# Altium schematic sheet CLK.SchDoc: CLK
size A4; SheetNumber: 1
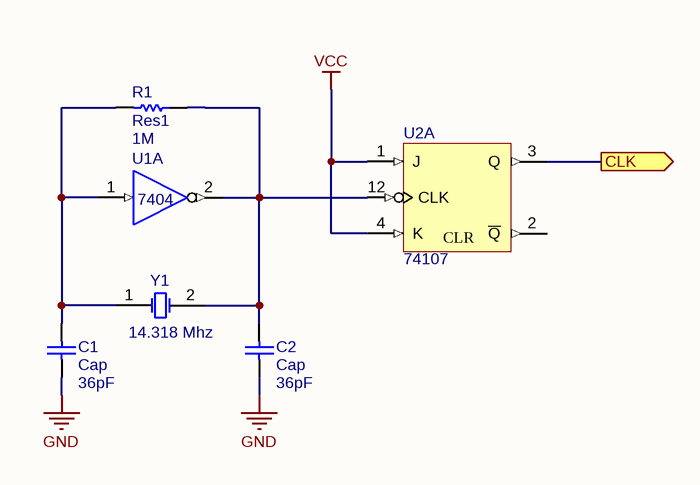
[diagram p0: CLK.SchDoc]

## Parts
C1  Cap  value 36pF  [CAPR10.16-11.5x3.6]
C2  Cap  value 36pF  [CAPR10.16-11.5x3.6]
R1  Res1  value 1M  [AXIAL-0.4]
U1  7404  [N014]  (part A of 6)
U2  74107  [N014D]  (part A of 2)
Y1  14.318 Mhz  [HC-49U]

## Ports
CLK

## Nets
GND: C1.1 C2.1 U1.7(GND) U2.7(GND)
VCC: U1.14(VCC) U2.1(J) U2.4(K) U2.13(CLR) U2.14(VCC)
CLK: U2.3(Q) ; port CLK
NetC1_2: C1.2 R1.2 U1.1(A) Y1.1(OSC1)
NetC2_2: C2.2 R1.1 U1.2(Y) U2.12(CLK) Y1.2(OSC2)

Not connected (* = marked no-connect by the designer): U2 2(~{Q})

## Notes on the sheet
- Text
- Page
- PONG

## Library data of the parts
C1 C2 = Cap: Capacitor; Published: 8-Jun-2000; LatestRevisionDate: 17-Jul-2002; LatestRevisionNote: Re-released for DXP Platform.; PackageReference: RAD-0.3; Publisher: Altium Limited; PackageDescription: Radial Cap, Thru-Hole; 2 Leads; 0.3 in Pin Spacing
R1 = Res1: Resistor; Published: 8-Jun-2000; LatestRevisionDate: 17-Jul-2002; LatestRevisionNote: Re-released for DXP Platform.; PackageReference: AXIAL-0.3; Publisher: Altium Limited; PackageDescription: Axial Device, Thru-Hole; 2 Leads; 0.3 in Pin Spacing
U1 = SN74LS04N: Hex Inverter; Published: 8-Jun-2000; LatestRevisionDate: 04-Mar-2005; LatestRevisionNote: Stylized 3D Model Added.; DatasheetVersion: Mar-1988; PackageVersion: Oct-1995; PackageReference: N014; Publisher: Altium Limited; PackageDescription: DIP; 14 Leads; Row Spacing 7.62 mm; Pitch 2.54 mm; ComponentLink1Description: Manufacturer Link; ComponentLink1URL: http://www.ti.com/; ComponentLink2Description: Datasheet; ComponentLink2URL: http://www-s.ti.com/sc/ds/sn74ls04.pdf
U2 = SN74HC107N: Dual J-K Negative-Edge-Triggered Flip-Flop with Clear; Published: 8-Jun-2000; LatestRevisionDate: 04-Mar-2005; LatestRevisionNote: Stylized 3D Model Added.; DatasheetVersion: Jun-1989; PackageVersion: Oct-1995; PackageReference: N014D; Publisher: Altium Limited; PackageDescription: DIP; 14 Leads; Row Spacing 7.62 mm; Pitch 2.54 mm; ComponentLink1Description: Manufacturer Link; ComponentLink1URL: http://www.ti.com/
Y1 = XTAL: Crystal Oscillator; Published: 8-Jun-2000; LatestRevisionDate: 17-Jul-2002; LatestRevisionNote: Re-released for DXP Platform.; PackageReference: R38; Publisher: Altium Limited; PackageDescription: Crystal, Thru-Hole; 2 Leads; Body 3.1 x 8.2 mm (Dia.xH)